# EAGLE design 190812-2 (EAGLE 9.4.2)
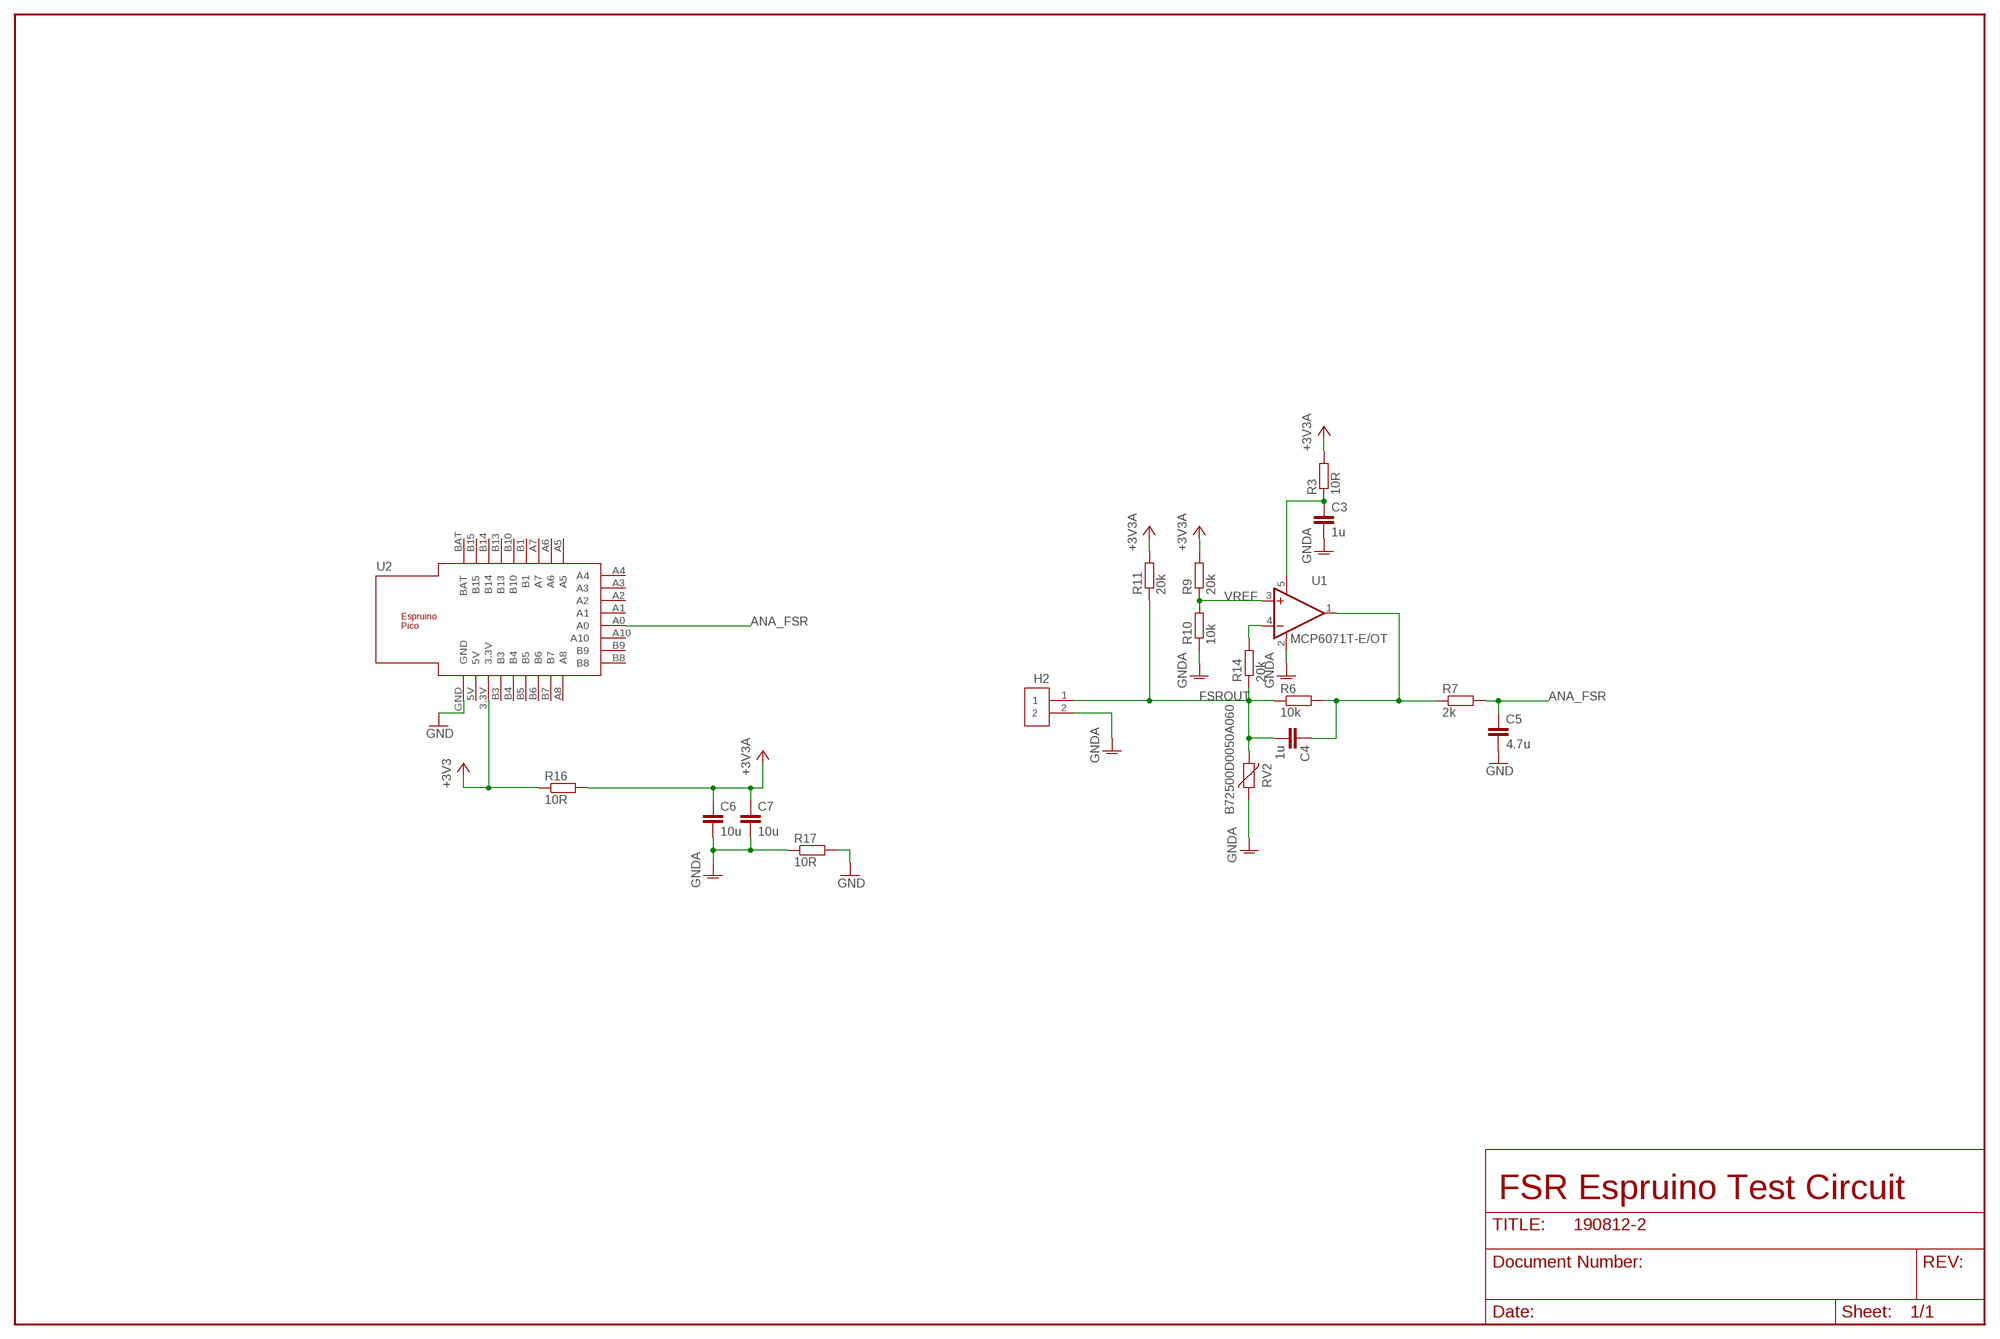
[diagram p0: schematic, sheet 1]

## Parts
C3  1u  C-EUC0603  [C0603]
C4  1u  C-EUC0805  [C0805]
C5  4.7u  C-EUC0805  [C0805]
C6  10u  C-EUC1206  [C1206]
C7  10u  C-EUC1206  [C1206]
H2  FSR-CONNECTOR-RUGER  [1X02]
R3  10R  R-EU_R0603  [R0603]
R6  10k  R-EU_R0603  [R0603]
R7  2k  R-EU_R0603  [R0603]
R9  20k  R-EU_R0603  [R0603]
R10  10k  R-EU_R0603  [R0603]
R11  20k  R-EU_R0603  [R0603]
R14  20k  R-EU_R0603  [R0603]
R16  10R  R-EU_R0603  [R0603]
R17  10R  R-EU_R0603  [R0603]
RV2  B72500D0050A060  [VARC1608X90]
U1  MCP6071T-E/OT  [SOT95P270X145-5]
U2  ESPRUINO_PICO_SMDONLY  [ESPRUINO_PICO_SMDONLY]

## Nets
+3V3: R16.1 U2.3.3V
+3V3A: C6.1 C7.1 R3.2 R9.2 R11.2 R16.2
ANA_FSR: C5.1 R7.2 U2.A0
FSR_OUT2: C4.1 R6.2 R7.1 U1.1(OUT)
FSROUT: C4.2 H2.1 R6.1 R11.1 R14.1 RV2.2
GND: C5.2 R17.2 U2.GND
GNDA: C3.2 C6.2 C7.2 H2.2 R10.1 R17.1 RV2.1 U1.2(V-)
N$1: C3.1 R3.1 U1.5(V+)
N$2: R14.2 U1.4(-IN)
VREF: R9.1 R10.2 U1.3(+IN)
Unconnected: U2.5V U2.A1 U2.A2 U2.A3 U2.A4 U2.A5 U2.A6 U2.A7 U2.A8 U2.A10 U2.B1 U2.B3 U2.B4 U2.B5 U2.B6 U2.B7 U2.B8 U2.B9 U2.B10 U2.B13 U2.B14 U2.B15 U2.BAT

## Notes on the sheet
- FSR Espruino Test Circuit

## Library data of the parts
C3-C7 = rcl:C-EU: CAPACITOR, European symbol; SPICEPREFIX: C
H2 = connectors-rmg:FSR-CONNECTOR-RUGER: FSR Connector for the Ruger Trigger project This is simply a 0.1" pin header connection. (2 positions).
R3 R6 R7 R9-R11 R14 R16 R17 = rcl:R-EU_: RESISTOR, European symbol; SPICEPREFIX: R
RV2 = diodes-rmg:B72500D0050A060: VARISTOR 6.4V 30A 0603 Maximum DC Volts 5.6V Varistor Voltage (Min) 6.4V Current - Surge 30A Energy - Number of Circuits 1 Capacitance @ Frequency 470pF @ 1MHz Operating Temperature -40°C ~ 85°C (TA)
U1 = analog-rmg:MCP6071T-E/OT: 110uA precision op amp 1.8V to 6.0V rail to rail input and output 1.2MHz GBP unity gain stable. 150uV offset voltage
U2 = espruino_pico:ESPRUINO_PICO_SMDONLY: Espruino Pico Created from Espruino library and modified by adding a 3D model from Fusion 360.

## Board
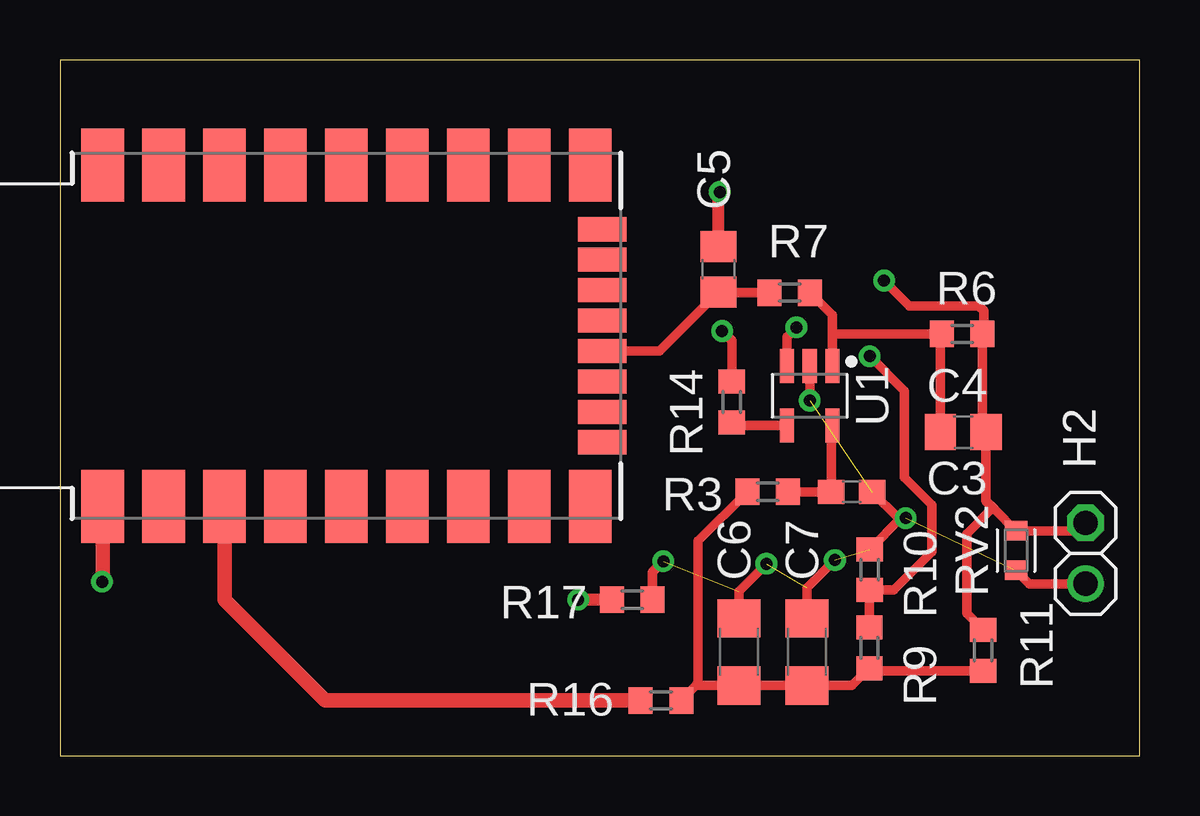
[diagram p1: board, top side]
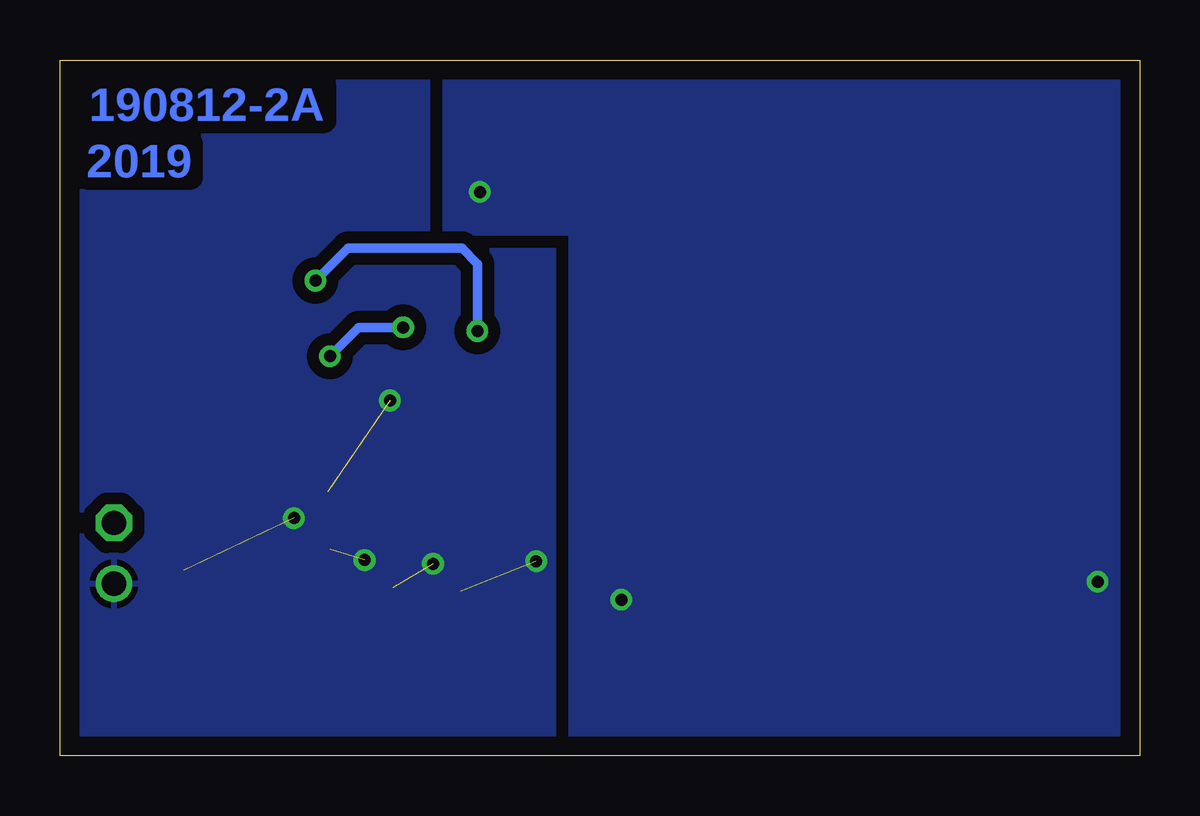
[diagram p2: board, bottom side, seen from below]

Size 45 x 29 mm. Coordinates in mm from the lower left corner, seen from the top.
Outline: 0,0 45,0 45,29 0,29 0,0
Copper layers (1*16): Top 0.035mm / dielectric 1.5mm / Bottom 0.035mm
Design rules "default *": minimum track width 0.25mm, minimum drill 0.4mm, track to track 0.25mm, track to pad 0.25mm, pad to pad 0.25mm, via to via 0.25mm, smd to smd 0.25mm, copper to edge 0.8mm, drill to drill 0.8mm, minimum pad ring 10mil, minimum via ring 8mil, stop-mask expansion 4mil, vias tented up to drill 0.5mm, thermal gap 10mil

### Footprints (pad centres in the part's own frame; a part is rotated, then mirrored left to right if it is on the bottom)
C0603 = smd 1.1 x 1: 1 -0.85,0; 2 0.85,0
C0805 = smd 1.3 x 1.5: 1 -0.95,0; 2 0.95,0
C1206 = smd 1.6 x 1.8: 1 -1.4,0; 2 1.4,0
1X02 = drill 1.016 octagon: 1 -2.54,0 | drill 1.016: 2 0,0
R0603 = smd 1 x 1.1: 1 -0.85,0; 2 0.85,0
VARC1608X90 = smd 0.821 x 0.929: 1 -0.825,0; 2 0.825,0
SOT95P270X145-5 = smd 1.412 x 0.59: 1 -1.247,0.95; 2 -1.247,0; 3 -1.247,-0.95; 4 1.247,-0.95; 5 1.247,0.95
ESPRUINO_PICO_SMDONLY = smd 1.778 x 3.048: 3.3V -8.89,-7.112; 5V -11.43,-7.112; A5 6.35,7.112; A6 3.81,7.112; A7 1.27,7.112; A8 6.35,-7.112; B1 -1.27,7.112; B3 -6.35,-7.112; B4 -3.81,-7.112; B5 -1.27,-7.112; B6 1.27,-7.112; B7 3.81,-7.112; B10 -3.81,7.112; B13 -6.35,7.112; B14 -8.89,7.112; B15 -11.43,7.112; BAT -13.97,7.112; GND -13.97,-7.112 | smd 2.032 x 1.016: A0 6.858,-0.635; A1 6.858,0.635; A2 6.858,1.905; A3 6.858,3.175; A4 6.858,4.445; A10 6.858,-1.905; B8 6.858,-4.445; B9 6.858,-3.175

### Placement (x,y rotation side)
C3  33,11 0 top
C4  37.65,13.48 0 top
C5  27.45,20.27 90 top
C6  28.3,4.32 90 top
C7  31.13,4.32 90 top
H2  42.75,7.16 270 top
R3  29.5,11 180 top
R6  37.6,17.58 180 top
R7  30.42,19.3 180 top
R9  33.74,4.49 270 top
R10  33.75,7.75 270 top
R11  38.48,4.39 270 top
R14  28,14.74 270 top
R16  25.05,2.3 0 top
R17  23.85,6.5 180 top
RV2  39.85,8.55 90 top
U1  31.25,15 270 top
U2  15.75,17.5 0 top

### Tracks (layer width: path | path; a pad name or v marks a point on that pad's centre or on a via)
+3V3
  Top 0.6: U2.3.3V 6.86,6.49 11.05,2.3 R16.1
+3V3A
  Top 0.4: 26.52,2.92 26.6,3 26.6,8.95 R3.2 | 26.52,2.92 C6.1 C7.1 33.02,2.92 R9.2 33.84,3.54 R11.2 | R16.2 26.52,2.92
ANA_FSR
  Top 0.4: U2.A0 25,16.86 C5.1 27.47,19.3 R7.2
FSR_OUT2
  Top 0.4: U1.1 32.2,17.6 | 32.2,17.6 32.2,18.37 R7.1 | 32.2,17.6 32.22,17.58 R6.2 36.7,17.53 C4.1
FSROUT  (via drill 0.5)
  Top 0.4: 38.96,10.26 38.6,10.62 C4.2 38.45,13.63 R6.1 38.5,17.63 38.5,18.55 38.3,18.75 35.4,18.75 v34.35,19.8 | 38.96,10.26 RV2.2 42.42,9.38 H2.1 | R11.1 37.8,5.92 37.8,9.25 38.81,10.26 38.96,10.26 | R14.1 28,17.3 v27.6,17.7
  Bottom 0.4: v34.35,19.8 33,21.15 28.25,21.15 27.6,20.5 v27.6,17.7
GND  (via drill 0.5)
  Top 0.5: R17.2 v21.6,6.5 | C5.2 27.45,23.45 v27.5,23.5
  Top 0.6: U2.GND 1.78,7.28 v1.75,7.25
  pour Bottom (isolate 0.5): 0,0 0,29 29,29 29,21.75 23.75,21.75 23.75,0
GNDA  (via drill 0.5)  (5 unrouted)
  Top 0.4: R17.1 24.7,7.65 v25.15,8.1 | C6.2 28.3,6.85 v29.45,8 | C7.2 31.13,6.98 v32.3,8.15 | RV2.1 40.41,7.16 H2.2 | R10.1 35.05,9.9 v35.25,9.9 34.95,9.9 C3.2 | U1.2 v31.25,14.8
  pour Bottom (isolate 0.5, rank 2): 45,29 29,29 29,21.25 23.75,21.25 23.75,0 45,0
N$1
  Top 0.4: R3.1 C3.1 32.15,13.7 U1.5
N$2
  Top 0.4: U1.4 28.14,13.75 R14.2
VREF  (via drill 0.5)
  Top 0.4: R9.1 R10.2 34.75,6.9 36.35,8.5 36.35,10.45 35.2,11.6 35.2,15.2 v33.75,16.65 | U1.3 30.3,17.45 v30.7,17.85
  Bottom 0.4: v30.7,17.85 32.55,17.85 v33.75,16.65

### Text on the board
Bottom: 190812-2A | 2019